# EAGLE design MovuinoHealthBandV0.2.7.2-max86141-v0.2.2-panel (EAGLE 9.6.2)
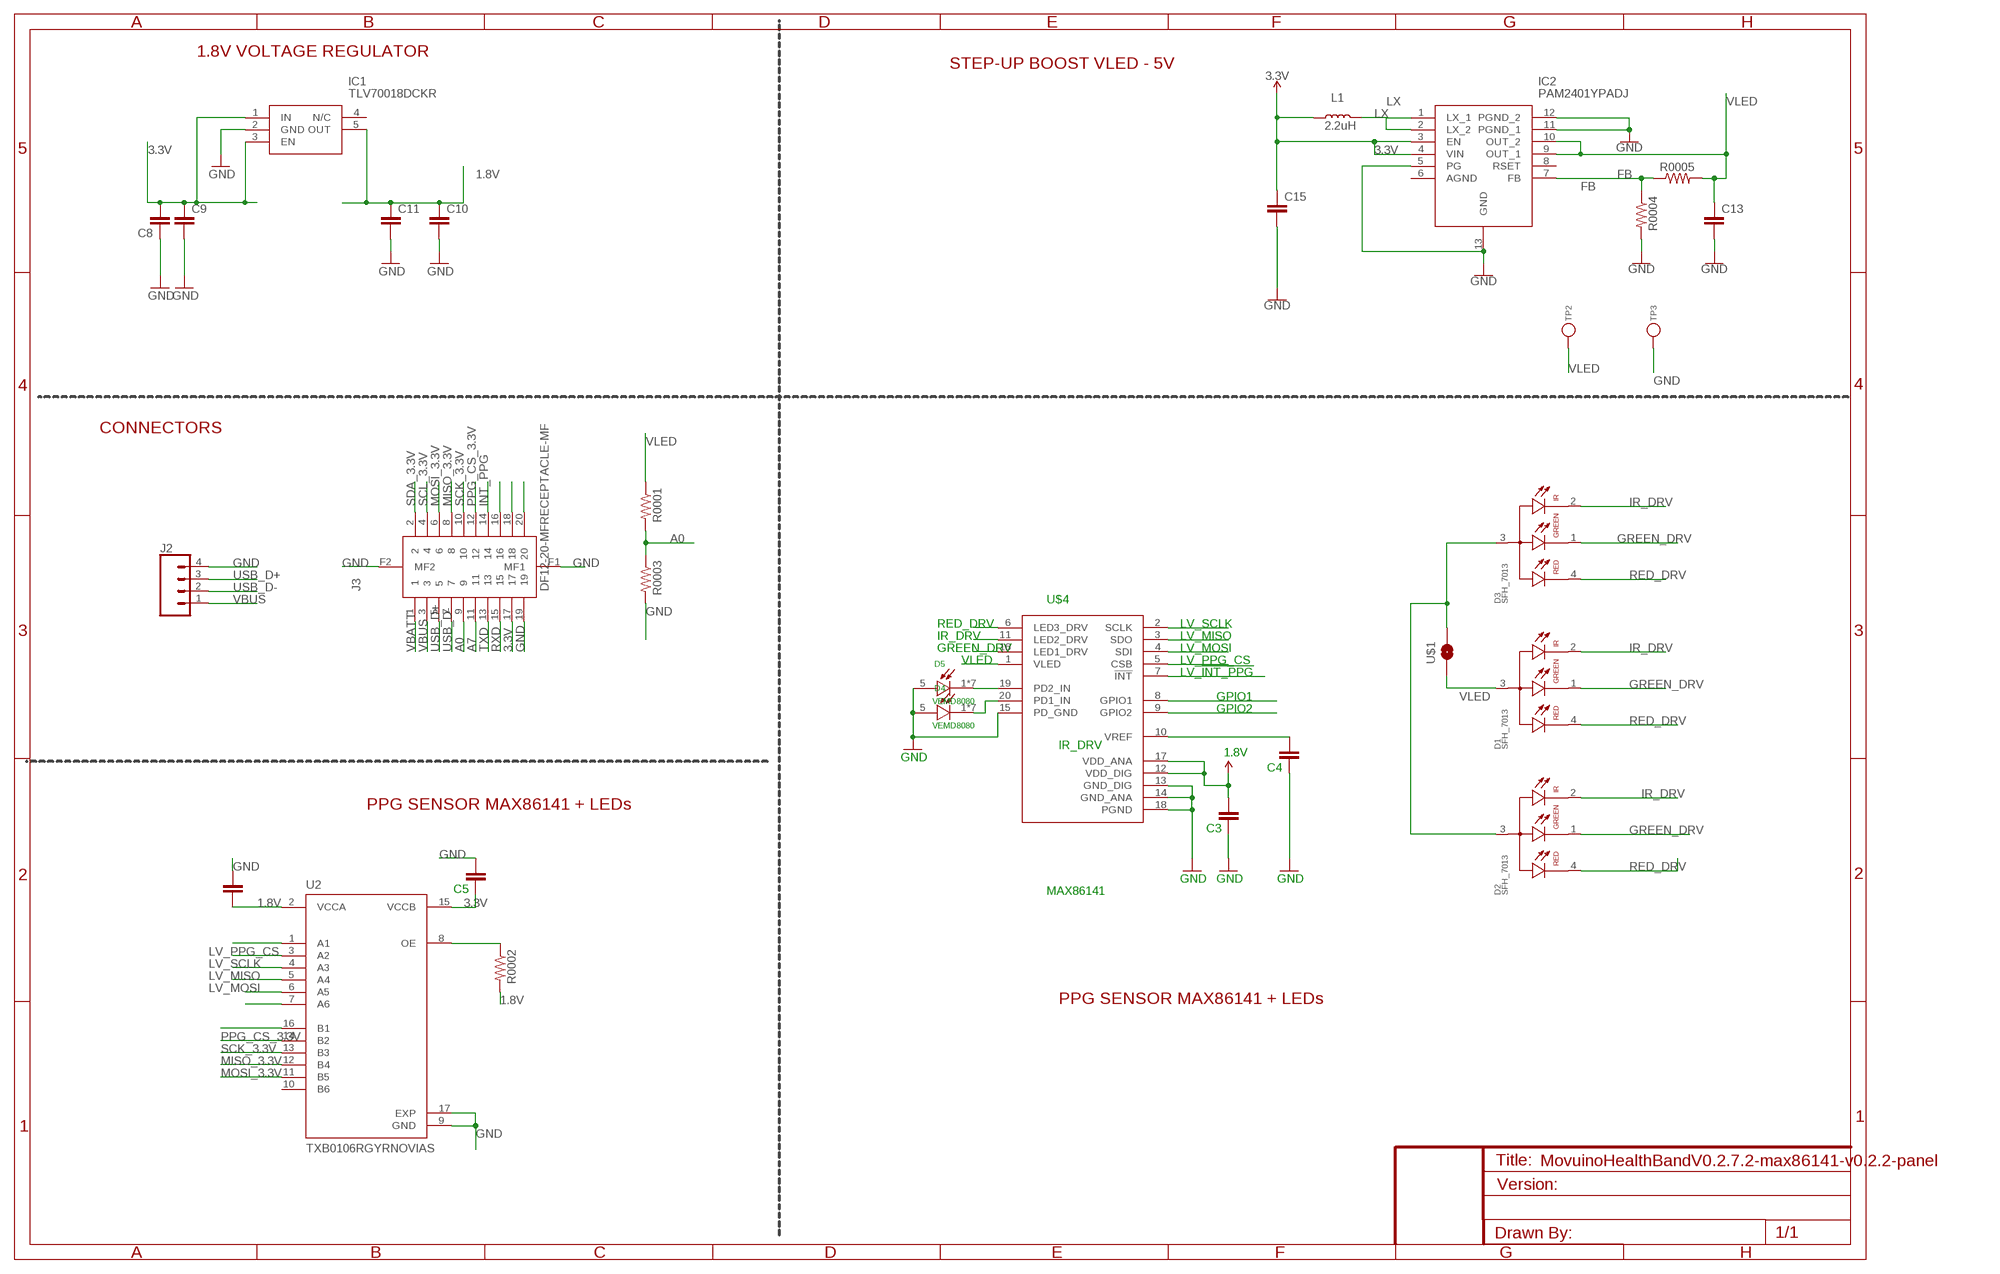
[diagram p0: schematic, sheet 1]

## Parts
C3  1uF  CAP0402-CAP  [0402-CAP]
C4  10uF  CAP0402-CAP  [0402-CAP]
C5  0.1uF  CAP0402-CAP  [0402-CAP]
C6  0.1uF  CAP0402-CAP  [0402-CAP]
C8  10uF  CAP0402-CAP-SMALL-TDOCU  [0402-CAP-SMALL-TDOCU]
C9  0.1uF  CAP0402-CAP-SMALL-TDOCU  [0402-CAP-SMALL-TDOCU]
C10  0.1uF  CAP0402-CAP-SMALL-TDOCU  [0402-CAP-SMALL-TDOCU]
C11  4.7uF  CAP0402-CAP-SMALL-TDOCU  [0402-CAP-SMALL-TDOCU]
C13  22uF  CAP0402-CAP-SMALL-TDOCU  [0402-CAP-SMALL-TDOCU]
C15  10uF  CAP0402-CAP-SMALL-TDOCU  [0402-CAP-SMALL-TDOCU]
D1  SFH_7013  [SFH_7013]
D2  SFH_7013  [SFH_7013]
D3  SFH_7013  [SFH_7013]
D4  VEMD8080  [XDCR_VEMD8080]
D5  VEMD8080  [XDCR_VEMD8080]
IC1  TLV70018DCKR  [SOT65P210X110-5N]
IC2  PAM2401YPADJ  [SON45P295X295X60-13N]
J2  CONN_04POGO-2.54  [POGO_2.54_X4]
J3  DF12-20-MFRECEPTACLE-MF  [DF12-20-DS]
L1  2.2uH  INDUCTOR  [INDC2016X100N]
R0001  100K  RESISTOR0402-RES  [0402-RES]
R0002  100K  RESISTOR0402-RES  [0402-RES]
R0003  100K  RESISTOR0402-RES  [0402-RES]
R0004  100K  RESISTOR0402-RES  [0402-RES]
R0005  750K  RESISTOR0402-RES  [0402-RES]
TP2  TESTPOINT1MM-ROUND-CREAM  [TESTPOINT_ROUND_1MM-CREAM]
TP3  TESTPOINT1MM-ROUND-CREAM  [TESTPOINT_ROUND_1MM-CREAM]
U2  TXB0106RGYRNOVIAS  [QFN50P400X350X100-17N-2]
U$1  0402-JUMPER  [0402-JUMPER]
U$4  MAX86141  [20_PIN_WLP]

## Nets
1.8V [JLCPCB-0.3/0.6]: C3.2 C6.1 C10.1 C11.1 IC1.5(OUT) R0002.2 U2.2(VCCA) U$4.12(VDD_DIG) U$4.17(VDD_ANA)
3.3V [JLCPCB-0.3/0.6]: C5.1 C8.2 C9.1 C15.1 IC1.1(IN) IC1.3(EN) IC2.3(EN) IC2.4(VIN) J3.17 L1.1 U2.15(VCCB)
A0 [JLCPCB-0.3/0.6]: J3.9 R0001.2 R0003.1
A7 [JLCPCB-0.3/0.6]: J3.11
FB [JLCPCB-0.3/0.6]: IC2.7(FB) R0004.1 R0005.1
GND [JLCPCB-0.3/0.6]: C3.1 C4.1 C5.2 C6.2 C8.1 C9.2 C10.2 C11.2 C13.2 C15.2 D4.5(A) D5.5(A) IC1.2(GND) IC2.5(PG) IC2.11(PGND_1) IC2.12(PGND_2) IC2.13(GND) J2.4 J3.19 J3.F1(MF1) J3.F2(MF2) R0003.2 R0004.2 TP3.P$1 U2.9(GND) U2.17(EXP) U$4.13(GND_DIG) U$4.14(GND_ANA) U$4.15(PD_GND) U$4.18(PGND)
GPIO1 [JLCPCB-0.3/0.6]: U$4.8(GPIO1)
GPIO2 [JLCPCB-0.3/0.6]: U$4.9(GPIO2)
GREEN_DRV [JLCPCB-0.3/0.6]: D1.1(CATHODE_EMITTER_2) D2.1(CATHODE_EMITTER_2) D3.1(CATHODE_EMITTER_2) U$4.16(LED1_DRV)
INT_PPG [JLCPCB-0.3/0.6]: J3.14
IR_DRV [JLCPCB-0.3/0.6]: D1.2(CATHODE_EMITTER_3) D2.2(CATHODE_EMITTER_3) D3.2(CATHODE_EMITTER_3) U$4.11(LED2_DRV)
LV_!INT_PPG! [JLCPCB-0.3/0.6]: U$4.7(!INT!)
LV_MISO [JLCPCB-0.3/0.6]: U2.5(A4) U$4.3(SDO)
LV_MOSI [JLCPCB-0.3/0.6]: U2.6(A5) U$4.4(SDI)
LV_PPG_CS [JLCPCB-0.3/0.6]: U2.3(A2) U$4.5(CSB)
LV_SCLK [JLCPCB-0.3/0.6]: U2.4(A3) U$4.2(SCLK)
LX [JLCPCB-0.3/0.6]: IC2.1(LX_1) IC2.2(LX_2) L1.2
MISO_3.3V [JLCPCB-0.3/0.6]: J3.8 U2.12(B4)
MOSI_3.3V [JLCPCB-0.3/0.6]: J3.6 U2.11(B5)
N$2: R0002.1 U2.8(OE)
N$3 [JLCPCB-0.3/0.6]: C4.2 U$4.10(VREF)
N$4 [JLCPCB-0.3/0.6]: D5.1(C) D5.2(C) D5.3(C) D5.4(C) D5.6(C) D5.7(C) D5.8(C) U$4.19(PD2_IN)
N$6: U2.1(A1)
N$7 [JLCPCB-0.3/0.6]: D4.1(C) D4.2(C) D4.3(C) D4.4(C) D4.6(C) D4.7(C) D4.8(C) U$4.20(PD1_IN)
N$8: D2.3(ANODE_EMITTER_1/2/3) D3.3(ANODE_EMITTER_1/2/3) U$1.2
N$19: U2.7(A6)
N$22: U2.16(B1)
N$25 [JLCPCB-0.3/0.6]: J3.16
N$26 [JLCPCB-0.3/0.6]: J3.18
N$27 [JLCPCB-0.3/0.6]: J3.20
PPG_CS_3.3V [JLCPCB-0.3/0.6]: J3.12 U2.14(B2)
RED_DRV [JLCPCB-0.3/0.6]: D1.4(CATHODE_EMITTER_1) D2.4(CATHODE_EMITTER_1) D3.4(CATHODE_EMITTER_1) U$4.6(LED3_DRV)
RXD [JLCPCB-0.3/0.6]: J3.15
SCK_3.3V [JLCPCB-0.3/0.6]: J3.10 U2.13(B3)
SCL_3.3V [JLCPCB-0.3/0.6]: J3.4
SDA_3.3V [JLCPCB-0.3/0.6]: J3.2
TXD [JLCPCB-0.3/0.6]: J3.13
USB_D+ [JLCPCB-0.3/0.6]: J2.3 J3.5
USB_D- [JLCPCB-0.3/0.6]: J2.2 J3.7
VBATT [JLCPCB-0.3/0.6]: J3.1
VBUS [JLCPCB-0.3/0.6]: J2.1 J3.3
VLED [JLCPCB-0.3/0.6]: C13.1 D1.3(ANODE_EMITTER_1/2/3) IC2.9(OUT_1) IC2.10(OUT_2) R0001.1 R0005.2 TP2.P$1 U$1.1 U$4.1(VLED)
Unconnected: IC1.4(N/C) IC2.6(AGND) IC2.8(RSET) U2.10(B6)

## Notes on the sheet
- 1.8V VOLTAGE REGULATOR
- STEP-UP BOOST VLED - 5V
- CONNECTORS
- PPG SENSOR MAX86141 + LEDs
- PPG SENSOR MAX86141 + LEDs

## Library data of the parts
C3-C6 C8-C11 C13 C15 = movuino:CAP: Capacitor Standard 0402 ceramic capacitor 0.1uF , 100nF
D1-D3 = movuino:SFH_7013: Red (655 nm), Green (530 nm) and Infrared Emitter (940 nm); AVAILABILITY: Unavailable; DESCRIPTION: Infrared (IR) Emitter 660nm, 526nm, 950nm 1.3V, 2.1V, 3V 40mA, 30mA, 60mA 1mW/sr @ 20mA 130° 4-SMD, No Lead; MF: OSRAM Opto; MP: SFH 7013; PACKAGE: SMD-4 OSRAM Opto Semiconductors Inc.; PRICE: None
D4 D5 = movuino:VEMD8080: SENSOR PHOTODIODE 850NM 8SMD Check prices <https://pricing.snapeda.com/search/part/VEMD8080/?ref=eda>; AVAILABILITY: Warning; DESCRIPTION: Photodiode 850nm 70ns 130° 8-SMD, No Lead; MF: Vishay Semiconductor Opto Division; MP: VEMD8080; PACKAGE: SMD-8 Vishay Semiconductor Opto Division; PRICE: None; PURCHASE-URL: https://pricing.snapeda.com/search/part/VEMD8080/?ref=eda
IC1 = movuino:TLV70018DCKR: 200-mA, Low-IQ, Low-Dropout Regulator for Portable Devices Source: Datasheet <http://www.ti.com/lit/gpn/tlv700>; DESCRIPTION: 200-mA, Low-IQ, Low-Dropout Regulator for Portable Devices; HEIGHT: 1.1mm; MANUFACTURER_NAME: Texas Instruments; MANUFACTURER_PART_NUMBER: TLV70018DCKR; MOUSER_PART_NUMBER: 595-TLV70018DCKR; MOUSER_PRICE-STOCK: https://www.mouser.com/Search/Refine.aspx?Keyword=595-TLV70018DCKR
IC2 = movuino:PAM2401YPADJ: Switching Voltage Regulators 1.0MHz Step-Up Conv 0.9 to 4.75V 3A 1KHz Source: Datasheet <https://componentsearchengine.com/Datasheets/1/PAM2401YPADJ.pdf>; DESCRIPTION: Switching Voltage Regulators 1.0MHz Step-Up Conv 0.9 to 4.75V 3A 1KHz; HEIGHT: 0.6mm; MANUFACTURER_NAME: Diodes Inc.; MANUFACTURER_PART_NUMBER: PAM2401YPADJ; MOUSER_PART_NUMBER: 621-PAM2401YPADJ; MOUSER_PRICE-STOCK: https://www.mouser.co.uk/ProductDetail/Diodes-Incorporated/PAM2401YPADJ?qs=Ay79KZaUeZCVTGl4%252BbGCig%3D%3D
J2 = movuino:CONN_04: Multi connection point. Often used as Generic Header-pin footprint for 0.1 inch spaced/style header connections On any of the 0.1 inch spaced packages, you can populate with these: Break Away Headers - Straight <https://www.sparkfun.com/products/116> (PRT-00116) Break Away Male Headers - Right Angle <https://www.sparkfun.com/products/553> (PRT-00553) Female Headers <https://www.sparkfun.com/products/115> (PRT-00115) Break Away Headers - Machine Pin <https://www.sparkfun.com/products/117> (PRT-00117) Break Away Female Headers - Swiss Machine Pin <https://www.sparkfun.com/products/743> (PRT-00743) For SCREWTERMINALS and SPRING TERMINALS visit here: Screw Terimnals on SparkFun.com <https://www.sparkfun.com/search/results?term=Screw+Terminals> (5mm/3.5mm/2.54mm spacing) This device is also useful as a general connection point to wire up your design to another part of your project. Our various solder wires solder well into these plated through hole pads. Hook-Up Wire - Assortment (Stranded, 22 AWG) <https://www.sparkfun.com/products/11375> (PRT-11375) Hook-Up Wire - Assortment (Solid Core, 22 AWG) <https://www.sparkfun.com/products/11367> (PRT-11367) View the entire wire category on our website here <https://www.sparkfun.com/categories/141> Special notes: Molex polarized connector foot print use with SKU : PRT-08231 with associated crimp pins and housings. 1MM SMD Version SKU: PRT-10208
J3 = movuino:DF12-20-MF: CONN 20POS 3.5-5MM SMD 0.5MM; DESCRIPTION: Receptacle metal fitting and Boss 3.5 mm - 5mm; MPN: DF12-20DS-0.5V(86)
L1 = movuino:INDUCTOR: Inductors Resist changes in electrical current. Basically a coil of wire. SparkFun Products: SparkFun Load Cell Amplifier - HX711 <https://www.sparkfun.com/products/13879> IOIO-OTG - V2.2 <https://www.sparkfun.com/products/13613>; MPN: LQM2MPN2R2MGHL
R0001-R0005 = movuino:RESISTOR: Resistor Basic schematic elements and footprints for 0402 , 0603, 1206, and PTH resistors.; TOLERANCE: 1%
TP2 TP3 = movuino:TESTPOINT: Test Point Various test points for characterisation and PCB testing TESTPOINT_SMT - Compact Surface Mount Test Point [Digikey: 5016KTR-ND]
U2 = movuino:TXB0106RGYR: 6-Bit Bidirectional Voltage-Level Translator with Auto Direction Sensing and +/-15-kV ESD Protect 16-VQFN -40 to 85 Check prices <https://pricing.snapeda.com/parts/TXB0106RGYR/Texas%20Instruments/view-part?ref=eda>
U$1 = movuino:0402-JUMPER
U$4 = movuino:MAX86141

## Net classes
1 pcbway_smallest: width 0.102 mm, drill 0.2 mm, clearance 0.102 mm
2 pcbway_cheap: width 0.004 mm, drill 0.3 mm, clearance 0.152 mm
3 pcbway_5mil: width 0.127 mm, drill 0.25 mm, clearance 0.127 mm
4 pcbway_4mil: width 0.102 mm, drill 0.2 mm, clearance 0.102 mm
5 EC-Class7-drill0.15: width 0.125 mm, drill 0.15 mm, clearance 0.125 mm
6 jlcpcb BGA: width 0.102 mm, drill 0.102 mm, clearance 0.125 mm
7 JLCPCB-0.3/0.6: width 0.127 mm, drill 0.3 mm, clearance 0.127 mm
8 JLCPCB_0.2/0.45: width 0.127 mm, drill 0.2 mm, clearance 0.127 mm

## Board
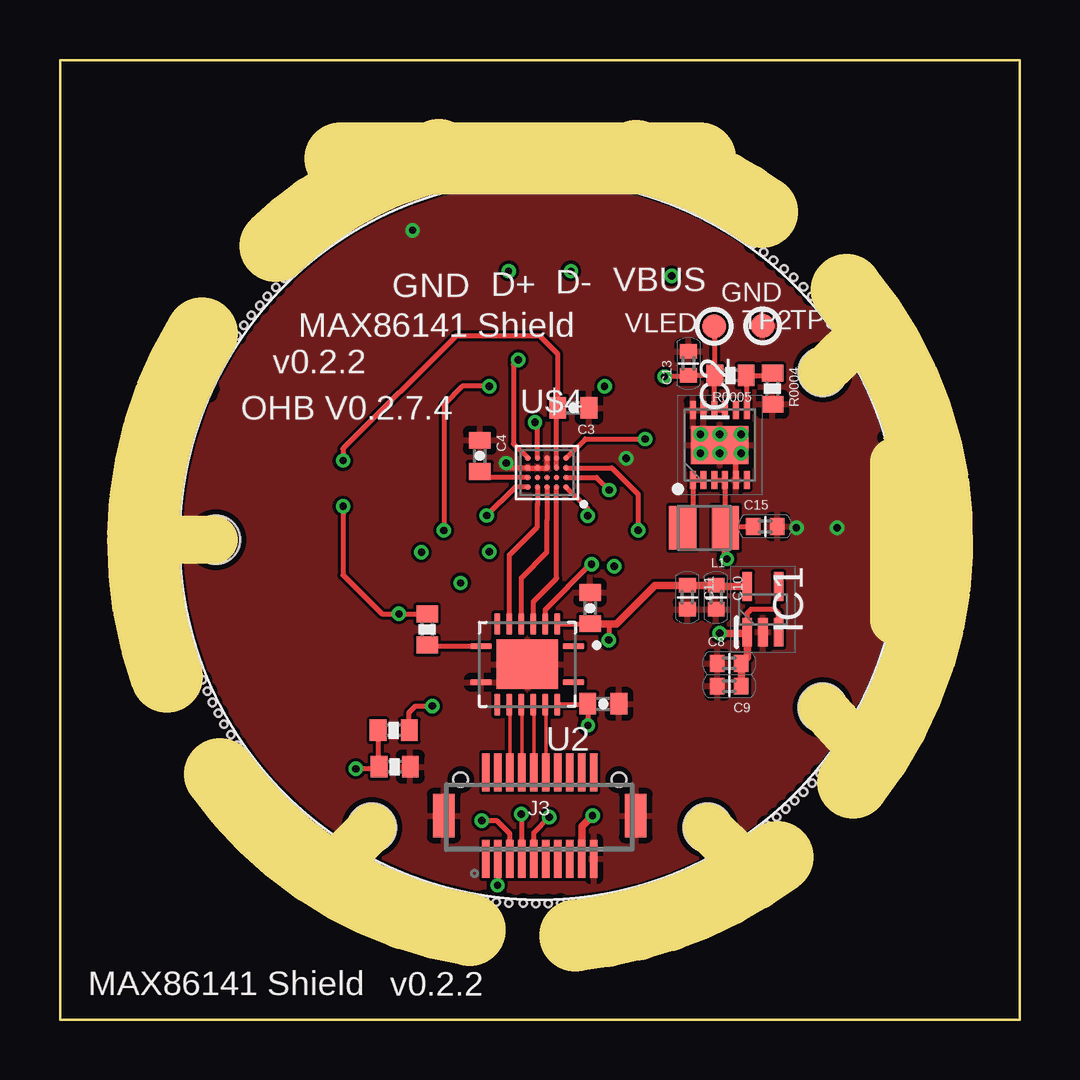
[diagram p1: board, top side]
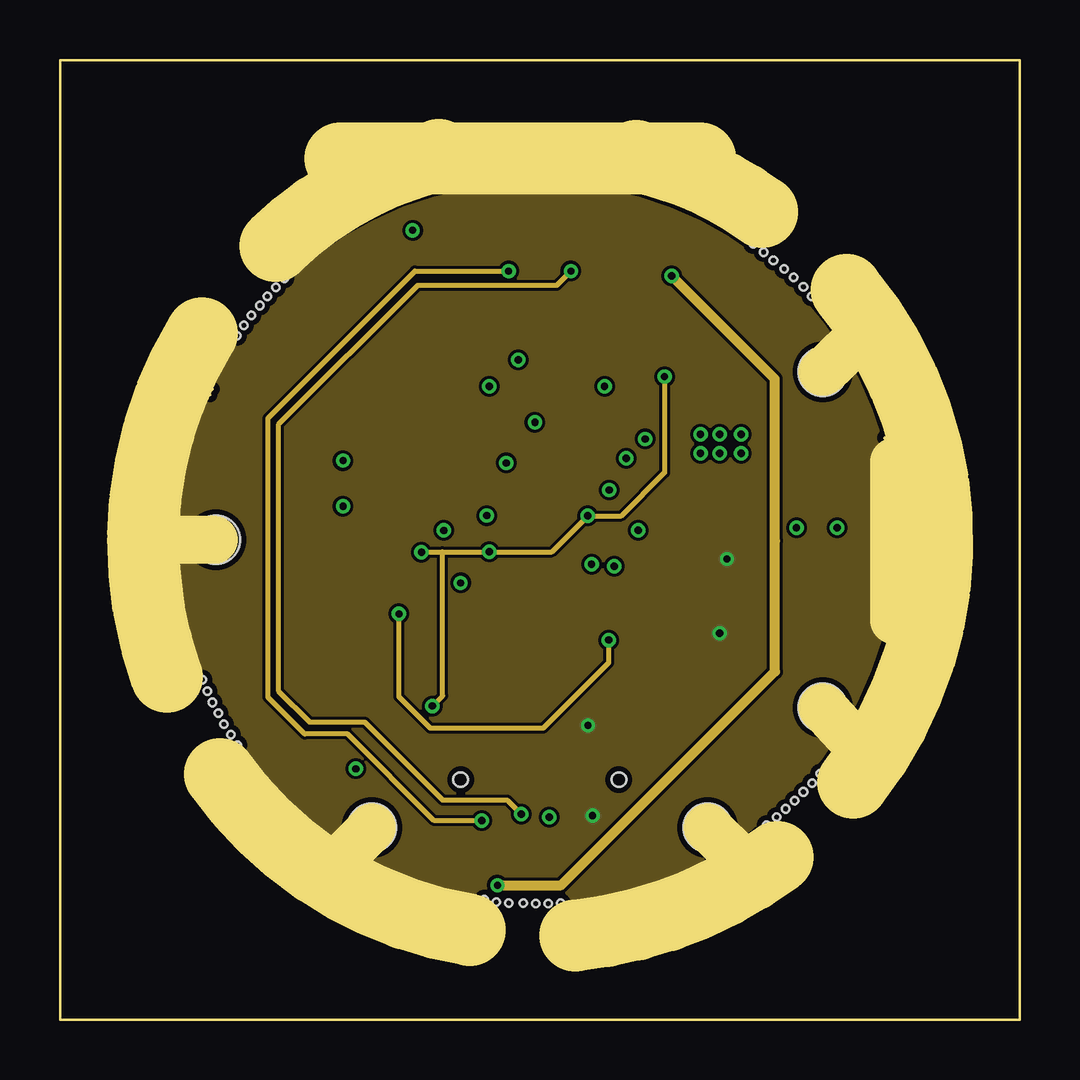
[diagram p2: board, inner layer VCC]
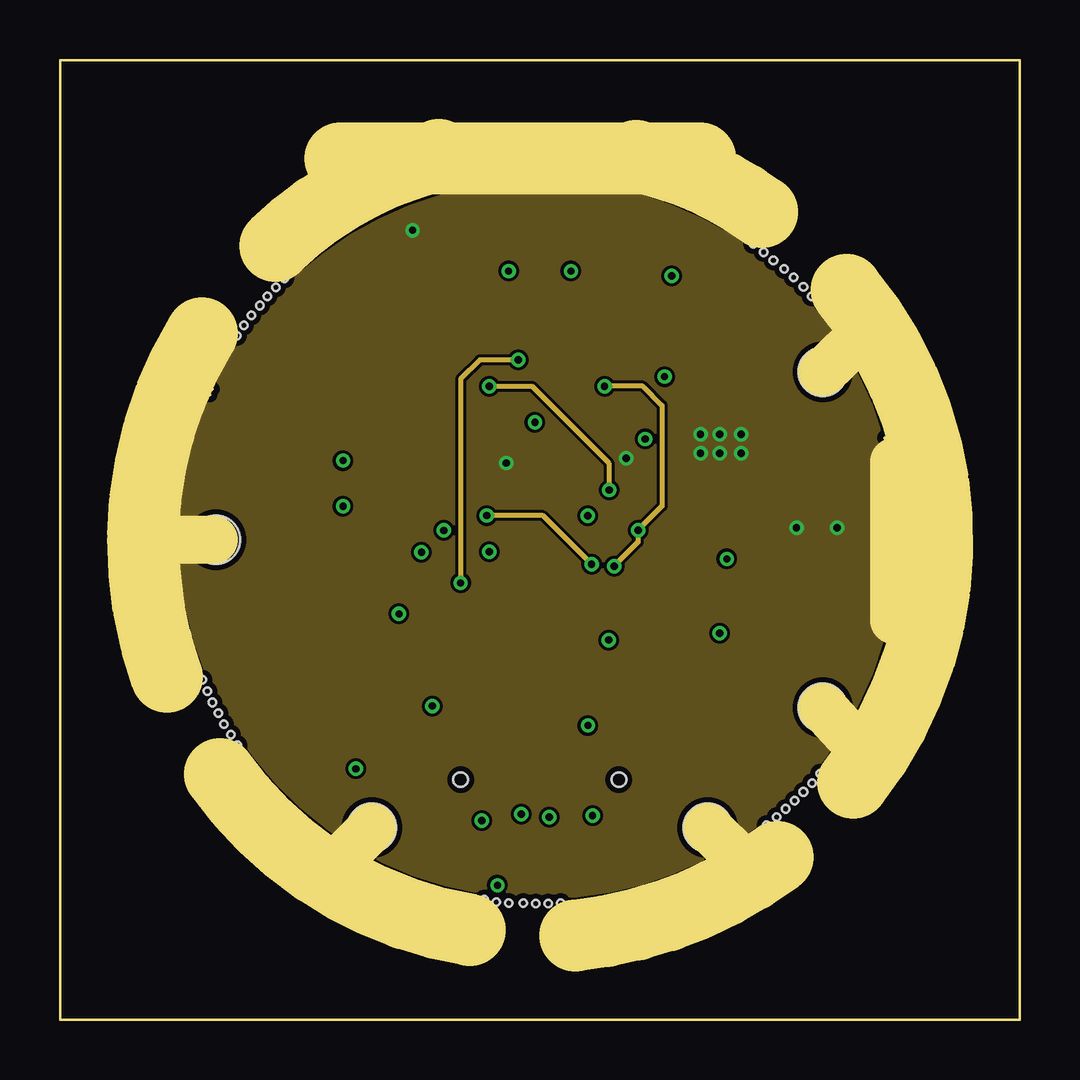
[diagram p3: board, inner layer GND]
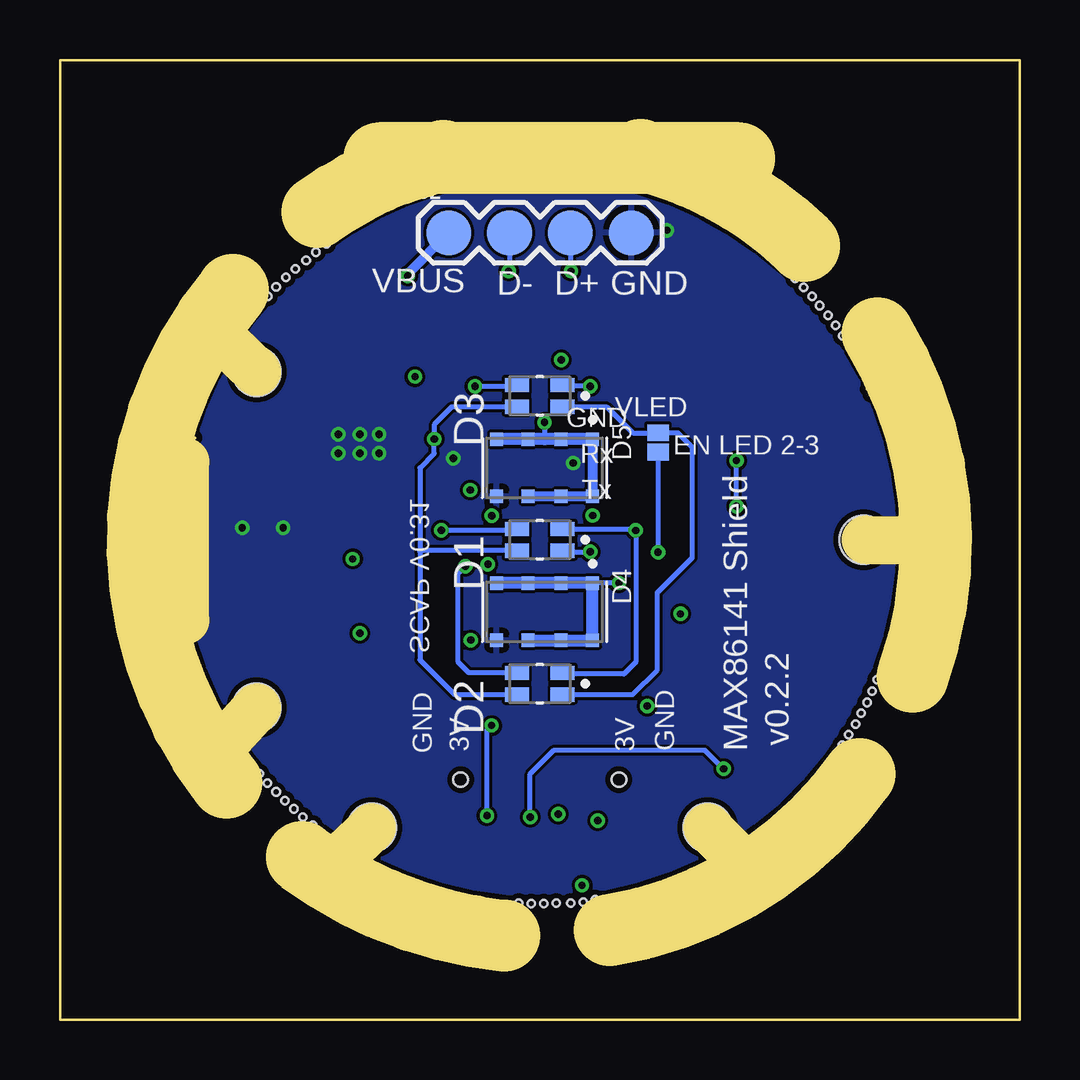
[diagram p4: board, bottom side, seen from below]

Size 40 x 40 mm. Coordinates in mm from the lower left corner, seen from the top.
Outline: 6.25,26.03 6.22,26.06
Outline: 6.33,26.25 6.36,26.28
Outline: 34.39,24.24 34.39,24.25
Outline: 0,40 0,0 40,0 40,40 0,40
Copper layers (1*2*15*16): Top 0.035mm / dielectric 0.2mm / VCC 0.0175mm / dielectric 0.3mm / GND 0.0175mm / dielectric 0.2mm / Bottom 0.035mm
Design rules "JLCPCB_4layer_DRU": minimum track width 5mil, minimum drill 0.2mm, track to track 5mil, track to pad 5mil, pad to pad 5mil, via to via 5mil, smd to smd 0mil, copper to edge 10mil, drill to drill 8mil, minimum pad ring 6mil, minimum via ring 0.125mm, stop-mask expansion 4mil, vias tented up to drill 25mil, thermal gap 10mil
Holes 2 mm at 6.5,20 31.8,27 31.8,13 13,8 27,8
Holes 0.3 mm at 17.69,5 18.71,4.86 19.31,4.85 19.83,4.83 20.36,4.83 20.88,4.85 18.19,4.89 29.46,8.11 29.88,8.43 30.25,8.78 30.63,9.12 30.99,9.49 31.35,9.85 31.68,10.25 28.89,32.34 29.34,31.99 29.74,31.64 30.19,31.29 30.59,30.94 30.99,30.54 31.34,30.14 5.93,14.17 6.14,13.68 6.36,13.22 6.6,12.77 6.84,12.32 7.12,11.87 7.4,11.43 7.37,28.5 7.66,28.93 7.98,29.35 8.33,29.76 8.65,30.15 9,30.52 9.36,30.89
Milling: 13 lines

### Footprints (pad centres in the part's own frame; a part is rotated, then mirrored left to right if it is on the bottom)
0402-CAP = smd 0.7 x 0.9: 1 -0.65,0; 2 0.65,0
0402-CAP-SMALL-TDOCU = smd 0.6 x 0.7: 1 -0.5,0; 2 0.5,0
SFH_7013 = smd 0.6 x 1: 1 -0.45,0.95; 2 0.45,0.95; 3 -0.45,-0.95; 4 0.45,-0.95
XDCR_VEMD8080 = smd 0.55 x 0.54: 1 -1.19,2; 2 -1.19,0.69; 3 -1.19,-0.69; 4 -1.19,-2; 5 1.19,-2; 6 1.19,-0.69; 7 1.19,0.69; 8 1.19,2
SOT65P210X110-5N = smd 1.2 x 0.4: 1 -0.95,0.65; 2 -0.95,0; 3 -0.95,-0.65; 4 0.95,-0.65; 5 0.95,0.65
SON45P295X295X60-13N = smd 0.75 x 0.25: 1 -1.45,1.125; 2 -1.45,0.675; 3 -1.45,0.225; 4 -1.45,-0.225; 5 -1.45,-0.675; 6 -1.45,-1.125; 7 1.45,-1.125; 8 1.45,-0.675; 9 1.45,-0.225; 10 1.45,0.225; 11 1.45,0.675; 12 1.45,1.125 | smd 1.6 x 2.4: 13 0,0
POGO_2.54_X4 = smd 1.88 x 1.88: 1 0,0; 2 2.54,0; 3 5.08,0; 4 7.62,0
DF12-20-DS = smd 0.3 x 1.6: 1 -2.25,-1.8; 2 -2.25,1.8; 3 -1.75,-1.8; 4 -1.75,1.8; 5 -1.25,-1.8; 6 -1.25,1.8; 7 -0.75,-1.8; 8 -0.75,1.8; 9 -0.25,-1.8; 10 -0.25,1.8; 11 0.25,-1.8; 12 0.25,1.8; 13 0.75,-1.8; 14 0.75,1.8; 15 1.25,-1.8; 16 1.25,1.8; 17 1.75,-1.8; 18 1.75,1.8; 19 2.25,-1.8; 20 2.25,1.8 | smd 0.9 x 1.8: F1 -4,0; F2 4,0 | hole 0.6: -3.3,1.5; 3.3,1.5
INDC2016X100N = smd 1.14 x 1.82: 1 -0.89,0; 2 0.89,0
0402-RES = smd 0.7 x 0.9: 1 -0.65,0; 2 0.65,0
TESTPOINT_ROUND_1MM-CREAM = smd 1 x 1: P$1 0,0
QFN50P400X350X100-17N-2 = smd 0.9 x 0.26: 1 -1.935,-0.75; 8 1.935,-0.75; 9 1.935,0.75; 16 -1.935,0.75 | smd 0.26 x 0.9: 2 -1.25,-1.685; 3 -0.75,-1.685; 4 -0.25,-1.685; 5 0.25,-1.685; 6 0.75,-1.685; 7 1.25,-1.685; 10 1.25,1.685; 11 0.75,1.685; 12 0.25,1.685; 13 -0.25,1.685; 14 -0.75,1.685; 15 -1.25,1.685 | smd 2.55 x 2.05: 17 0,0
0402-JUMPER = smd 0.7 x 0.9: 1 -0.4,0; 2 0.4,0
20_PIN_WLP = smd 0.22 x 0.22: 1 -0.8,0.6; 2 -0.4,0.6; 3 0,0.6; 4 0.4,0.6; 5 0.8,0.6; 6 -0.8,0.2; 7 -0.4,0.2; 8 0,0.2; 9 0.4,0.2; 10 0.8,0.2; 11 -0.8,-0.2; 12 -0.4,-0.2; 13 0,-0.2; 14 0.4,-0.2; 15 0.8,-0.2; 16 -0.8,-0.6; 17 -0.4,-0.6; 18 0,-0.6; 19 0.4,-0.6; 20 0.8,-0.6

### Placement (x,y rotation side)
C3  21.4,25.5 180 top
C4  17.5,23.5 270 top
C5  22.65,13.16 0 top
C6  22.1,17.15 90 top
C8  27.9,14.85 0 top
C9  27.9,13.9 180 top
C10  27.35,17.6 270 top
C11  26.15,17.6 270 top
C13  26.2,27.35 90 top
C15  29.4,20.55 0 top
D1  20,20 90 bottom
D2  20,14 90 bottom
D3  20,26 90 bottom
D4  19.8,17 270 bottom
D5  19.8,23 270 bottom
IC1  29.3,17.1 90 top
IC2  27.5,23.95 90 top
J2  23.8,32.8 0 bottom
J3  20,8.5 0 top
L1  26.85,20.5 180 top
R0001  13.91,12.06 180 top
R0002  15.31,16.26 90 top
R0003  13.95,10.54 0 top
R0004  29.7,26.3 270 top
R0005  27.95,26.85 180 top
TP2  27.28,28.9 0 top
TP3  29.29,28.91 0 top
U2  19.48,14.81 180 top
U$1  15.07,24.06 90 bottom
U$4  20.3,22.8 180 top

### Tracks (layer width: path | path; a pad name or v marks a point on that pad's centre or on a via)
1.8V  (via drill 0.3 pad 0.6)
  Top 0.2: U$4.12 U$4.17 20.7,25.35 C3.2 20.75,27.75 20,28.5 16.5,28.5 11.8,23.8 v11.8,23.3 | U2.2 C6.1 | R0002.2 v14.13,16.91 13.42,16.91 11.8,18.53 v11.8,21.4 | 22.88,16.5 v22.88,15.83 v22.87,15.82
  Top 0.305: IC1.5 27.4,18.05 C10.1 C11.1 24.8,18.1 23.2,16.5 22.88,16.5 C6.1
  VCC 0.2: v22.87,15.82 22.87,14.87 20.14,12.14 15.44,12.14 14.13,13.45 v14.13,16.91
  Bottom 0.2: v11.8,21.4 v11.8,23.3
3.3V  (via drill 0.3 pad 0.6)
  Top 0.2: IC2.3 IC2.4 27.73,20.52 L1.1 27.79,20.55 C15.1 | IC1.1 28.65,16.95 28.8,17.1 29.8,17.1 29.95,16.95 IC1.3 | U2.15 21.96,13.12 C5.1 v22,12.27 v22.01,12.26
  Top 0.305: J3.17 21.75,8.05 v22.2,8.5 | L1.1 27.74,19.26 v27.8,19.2 | v27.5,16.1 28.6,16.1 IC1.1 28.65,15.1 C8.2 C9.1
  Bottom 0.2: v22.2,8.5 22.2,12.07 v22.01,12.26
  pour VCC: 5,19.8 5,20.2 arc-90 19.6,34.8 20.1,34.8 arc-90 34.8,20.1 arc-90 19.5,4.8 19.4,4.8 arc-90 5,19.2
A0  (via drill 0.3 pad 0.6)
  Top 0.2: J3.9 19.75,7.79 v20.4,8.44 | v12.33,10.45 13.21,10.45 R0003.1 13.26,10.58 R0001.2
  Bottom 0.2: v20.4,8.44 20.4,10.23 19.4,11.23 13.13,11.23 12.35,10.45 v12.33,10.45
FB
  Top 0.203: IC2.7 28.62,26.82 R0005.1 29.6,26.85 R0004.1
GND  (via drill 0.3 pad 0.6)
  Top 0.2: U$4.18 U$4.13 U$4.14 U$4.15 18.8,23 v18.6,23.2 | IC2.5 28.18,23.27 IC2.13
  other vias: 23.6,23.4 26.7,24.4 27.5,24.4 28.4,24.4 28.4,23.6 27.5,23.6 26.7,23.6 30.7,20.5 32.4,20.5 14.7,32.9
  pour Top: 5.24,20.01 arc-90 20.04,34.81 arc-90 34.84,20.01 arc-90 20.04,5.21 arc-90
  pour Bottom: 5.21,20.04 arc-90 20.01,34.84 arc-90 34.81,20.04 arc-90 20.01,5.24 arc-90
  pour GND: 5,19.9 arc-90 20,34.9 20.2,34.9 arc-90 34.8,20.3 34.8,19.7 arc-90 20.2,5.1 arc-90
GREEN_DRV  (via drill 0.3 pad 0.6)
  Top 0.2: U$4.16 21.9,24.2 v24.4,24.2
  Bottom 0.2: D3.1 23.65,25.55 24.4,24.8 v24.4,24.2 24.4,23.6 25,23 25,19.5 | D2.1 23.55,13.55 25,15 25,19.5 | D1.1 24.95,19.55 25,19.5
IR_DRV  (via drill 0.3 pad 0.6)
  Top 0.2: U$4.11 23,23 24.1,21.9 v24.1,20.4
  GND 0.2: v22.7,26.4 24.3,26.4 25.1,25.6 25.1,21.4 v24.1,20.4 24.1,19.9 v23.1,18.9
  Bottom 0.2: D2.2 22.95,14.45 23.4,14.9 23.4,18.6 v23.1,18.9 | v24.1,20.4 21,20.4 D1.2 | v22.7,26.4 21,26.4 D3.2
LV_MISO
  Top 0.2: U$4.3 20.3,20.8 20.3,19.48 19.23,18.41 U2.5
LV_MOSI
  Top 0.2: U$4.4 19.9,21.47 19.9,21.4 19.9,20.54 18.73,19.37 U2.6
LV_PPG_CS  (via drill 0.3 pad 0.6)
  Top 0.2: U$4.5 19,22.2 18.98,22.2 v17.79,21.01 | U2.3 20.23,17.09 22.12,18.98 v22.16,18.98
  GND 0.2: v22.16,18.98 20.13,21.01 v17.79,21.01
LV_SCLK
  Top 0.2: U$4.2 20.7,18.39 19.73,17.42 U2.4
LX
  Top 0.2: L1.2 26.38,20.91 IC2.1 IC2.2
MISO_3.3V
  Top 0.152: J3.8 19.25,13.11 U2.12
MOSI_3.3V
  Top 0.152: J3.6 18.75,13.11 U2.11
N$2
  Top 0.2: U2.8 15.36,15.56 R0002.1
N$3
  Top 0.2: U$4.10 17.75,22.6 C4.2
N$4  (via drill 0.3 pad 0.6)
  Top 0.2: U$4.19 19.9,24.8 v19.8,24.9
  Bottom 0.2: v19.8,24.9 19.8,24.19
  Bottom 0.406: D5.1 D5.8 D5.7 D5.6
  Bottom 0.508: D5.1 D5.2 19.8,24.19 D5.3 D5.4
N$7  (via drill 0.3 pad 0.6)
  Top 0.2: U$4.20 18.9,24 18.9,27.3 v19.1,27.5
  GND 0.2: v19.1,27.5 17.5,27.5 16.7,26.7 v16.7,18.2
  Bottom 0.2: v16.7,18.2 D4.1
  Bottom 0.508: D4.4 D4.3 D4.2 D4.1 D4.8 D4.7 D4.6
N$8
  Bottom 0.2: D3.3 17.22,25.55 16.12,24.45 U$1.2 | U$1.2 | D2.3 16.13,13.55 15.1,14.58 15.1,17.8 13.64,19.26 13.64,23.85 14.24,24.45 U$1.2
PPG_CS_3.3V
  Top 0.152: J3.12 20.25,13.11 U2.14
RED_DRV  (via drill 0.3 pad 0.6)
  Top 0.2: U$4.6 22.37,22.6 v22.9,22.07 | v17.9,26.4 16.77,26.4 16,25.63 v16,20.39
  GND 0.2: v22.9,22.07 22.9,23.17 19.67,26.4 v17.9,26.4
  Bottom 0.2: v17.9,26.4 19,26.4 D3.4 | D2.4 19,14.4 16.5,14.4 16,14.9 v16,20.39 16,20.5 16.05,20.45 D1.4
SCK_3.3V
  Top 0.152: J3.10 19.75,11.55 19.75,13.11 U2.13
USB_D+  (via drill 0.3 pad 0.6)
  Top 0.2: J3.5 18.75,7.75 18.21,8.29 v17.58,8.29
  VCC 0.2: v18.7,31.2 14.8,31.2 8.67,25.07 8.67,13.43 10.2,11.9 11.99,11.9 15.6,8.29 v17.58,8.29
  Bottom 0.2: v18.7,31.2 18.7,32.78 J2.3
USB_D-  (via drill 0.3 pad 0.6)
  Top 0.2: J3.7 19.25,8.54 v19.23,8.56
  VCC 0.2: v21.3,31.2 20.7,30.6 14.9,30.6 9.1,24.8 9.1,13.7 10.4,12.4 12.7,12.4 15.96,9.14 18.65,9.14 v19.23,8.56
  Bottom 0.2: J2.2 21.26,31.24 v21.3,31.2
VBUS  (via drill 0.3 pad 0.6)
  Top 0.2: J3.3 18.25,5.61 v18.24,5.59
  VCC 0.406: v25.5,31 29.8,26.7 29.8,19.96 29.8,19.95 29.8,14.5 20.89,5.59 v18.24,5.59
  Bottom 0.406: J2.1 25.5,31.1 v25.5,31
VLED  (via drill 0.3 pad 0.6)
  Top 0.2: IC2.10 IC2.9 | U$4.1 22,21.3 v22,21 | R0001.1 14.56,12.81 14.82,13.07 v15.52,13.07 | TP2.P$1 27.3,28.88 R0005.2 C13.1 26.15,26.8 v25.2,26.8
  Top 0.203: IC2.10 27.27,26.82 R0005.2
  VCC 0.2: 23.4,21 v22,21 20.5,19.5 v17.9,19.5 15.93,19.5 | v15.07,19.48 15.09,19.5 15.93,19.5 | v15.52,13.07 15.95,13.5 15.95,19.48 15.93,19.5
  VCC 0.203: v25.2,26.8 25.2,22.8 23.4,21
  Bottom 0.2: D1.3 19,19.5 v17.9,19.5 | U$1.1 v15.07,19.48

### Text on the board
tPlace: GND | D+ | D- | VBUS | GND | MAX86141 Shield | VLED | v0.2.2 | OHB V0.2.7.4 | MAX86141 Shield | v0.2.2
bPlace: GND | D+ | D- | VBUS | ---VLED | EN LED 2-3 | v0.2.2 | MAX86141 Shield
bNames: GND | Rx | Tx | SCAP V0.31 | GND | 3V | 3V | GND